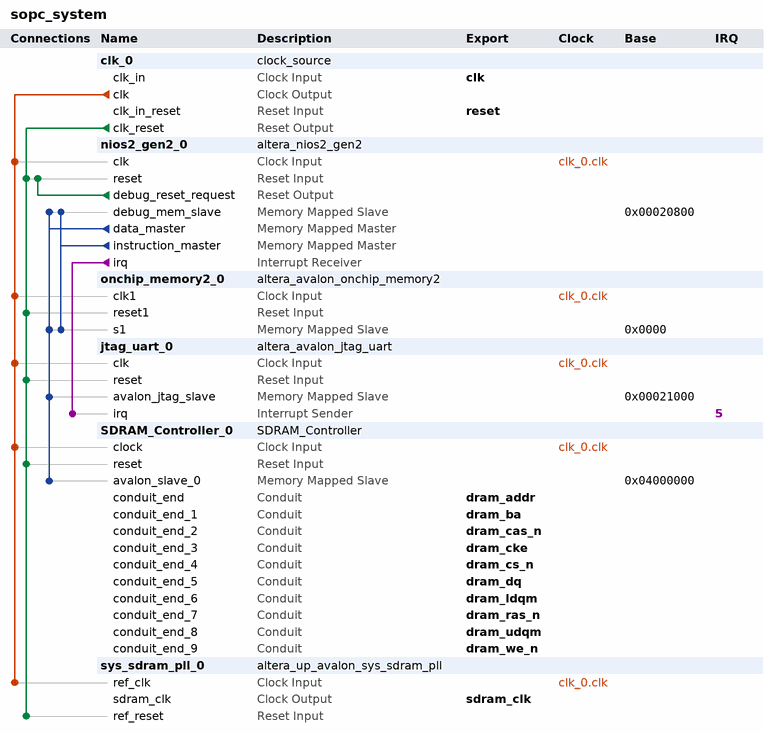
[diagram p0: system contents]
# Platform Designer (Qsys) system sopc_system, Cyclone V 5CSEMA5F31C6
# Parameters at their usual value, and those the tool derives, are not listed.
package require -exact qsys 17.1
create_system sopc_system
set_project_property DEVICE_FAMILY {Cyclone V}
set_project_property DEVICE 5CSEMA5F31C6

add_instance clk_0 clock_source 17.1
set_instance_parameter_value clk_0 clockFrequency 50000000

add_instance nios2_gen2_0 altera_nios2_gen2 17.1
set_instance_parameter_value nios2_gen2_0 dcache_size 2048
set_instance_parameter_value nios2_gen2_0 exceptionSlave onchip_memory2_0.s1
set_instance_parameter_value nios2_gen2_0 icache_size 4096
set_instance_parameter_value nios2_gen2_0 impl Fast
set_instance_parameter_value nios2_gen2_0 resetSlave onchip_memory2_0.s1

add_instance onchip_memory2_0 altera_avalon_onchip_memory2 17.1
set_instance_parameter_value onchip_memory2_0 dataWidth 32
set_instance_parameter_value onchip_memory2_0 dualPort false
set_instance_parameter_value onchip_memory2_0 initMemContent true
set_instance_parameter_value onchip_memory2_0 initializationFileName onchip_mem.hex
set_instance_parameter_value onchip_memory2_0 memorySize 131072

add_instance jtag_uart_0 altera_avalon_jtag_uart 17.1
set_instance_parameter_value jtag_uart_0 simInteractiveOptions NO_INTERACTIVE_WINDOWS

add_instance SDRAM_Controller_0 SDRAM_Controller 1.0

add_instance sys_sdram_pll_0 altera_up_avalon_sys_sdram_pll 17.1
set_instance_parameter_value sys_sdram_pll_0 CV_boards DE1-SoC
set_instance_parameter_value sys_sdram_pll_0 gui_outclk 50.0
set_instance_parameter_value sys_sdram_pll_0 gui_refclk 50.0

# connections
add_connection clk_0.clk jtag_uart_0.clk clock
add_connection clk_0.clk nios2_gen2_0.clk clock
add_connection clk_0.clk onchip_memory2_0.clk1 clock
add_connection clk_0.clk SDRAM_Controller_0.clock clock
add_connection clk_0.clk sys_sdram_pll_0.ref_clk clock
add_connection clk_0.clk_reset jtag_uart_0.reset reset
add_connection clk_0.clk_reset nios2_gen2_0.reset reset
add_connection clk_0.clk_reset onchip_memory2_0.reset1 reset
add_connection clk_0.clk_reset SDRAM_Controller_0.reset reset
add_connection clk_0.clk_reset sys_sdram_pll_0.ref_reset reset
add_connection nios2_gen2_0.debug_reset_request nios2_gen2_0.reset reset
add_connection nios2_gen2_0.data_master jtag_uart_0.avalon_jtag_slave avalon
set_connection_parameter_value nios2_gen2_0.data_master/jtag_uart_0.avalon_jtag_slave baseAddress 0x00021000
add_connection nios2_gen2_0.data_master nios2_gen2_0.debug_mem_slave avalon
set_connection_parameter_value nios2_gen2_0.data_master/nios2_gen2_0.debug_mem_slave baseAddress 0x00020800
add_connection nios2_gen2_0.data_master onchip_memory2_0.s1 avalon
set_connection_parameter_value nios2_gen2_0.data_master/onchip_memory2_0.s1 baseAddress 0x0000
add_connection nios2_gen2_0.data_master SDRAM_Controller_0.avalon_slave_0 avalon
set_connection_parameter_value nios2_gen2_0.data_master/SDRAM_Controller_0.avalon_slave_0 baseAddress 0x04000000
add_connection nios2_gen2_0.instruction_master nios2_gen2_0.debug_mem_slave avalon
set_connection_parameter_value nios2_gen2_0.instruction_master/nios2_gen2_0.debug_mem_slave baseAddress 0x00020800
add_connection nios2_gen2_0.instruction_master onchip_memory2_0.s1 avalon
set_connection_parameter_value nios2_gen2_0.instruction_master/onchip_memory2_0.s1 baseAddress 0x0000
add_connection nios2_gen2_0.irq jtag_uart_0.irq interrupt
set_connection_parameter_value nios2_gen2_0.irq/jtag_uart_0.irq irqNumber 5

# exported interfaces
add_interface clk clock sink
set_interface_property clk EXPORT_OF clk_0.clk_in
add_interface dram_addr conduit end
set_interface_property dram_addr EXPORT_OF SDRAM_Controller_0.conduit_end
add_interface dram_ba conduit end
set_interface_property dram_ba EXPORT_OF SDRAM_Controller_0.conduit_end_1
add_interface dram_cas_n conduit end
set_interface_property dram_cas_n EXPORT_OF SDRAM_Controller_0.conduit_end_2
add_interface dram_cke conduit end
set_interface_property dram_cke EXPORT_OF SDRAM_Controller_0.conduit_end_3
add_interface dram_cs_n conduit end
set_interface_property dram_cs_n EXPORT_OF SDRAM_Controller_0.conduit_end_4
add_interface dram_dq conduit end
set_interface_property dram_dq EXPORT_OF SDRAM_Controller_0.conduit_end_5
add_interface dram_ldqm conduit end
set_interface_property dram_ldqm EXPORT_OF SDRAM_Controller_0.conduit_end_6
add_interface dram_ras_n conduit end
set_interface_property dram_ras_n EXPORT_OF SDRAM_Controller_0.conduit_end_7
add_interface dram_udqm conduit end
set_interface_property dram_udqm EXPORT_OF SDRAM_Controller_0.conduit_end_8
add_interface dram_we_n conduit end
set_interface_property dram_we_n EXPORT_OF SDRAM_Controller_0.conduit_end_9
add_interface reset reset sink
set_interface_property reset EXPORT_OF clk_0.clk_in_reset
add_interface sdram_clk clock source
set_interface_property sdram_clk EXPORT_OF sys_sdram_pll_0.sdram_clk

set_interconnect_requirement {$system} qsys_mm.clockCrossingAdapter HANDSHAKE
set_interconnect_requirement {$system} qsys_mm.enableEccProtection FALSE
set_interconnect_requirement {$system} qsys_mm.insertDefaultSlave FALSE
set_interconnect_requirement {$system} qsys_mm.maxAdditionalLatency 1

save_system sopc_system.qsys
